# Altium schematic sheet LPC1768.SchDoc: LPC1768
size A4; Organization: UNSW Solar Racing Team; Address3: UNSW; Address4: Sydney NSW 2052; Address2: Electrical Engineering; Address1: Room 342
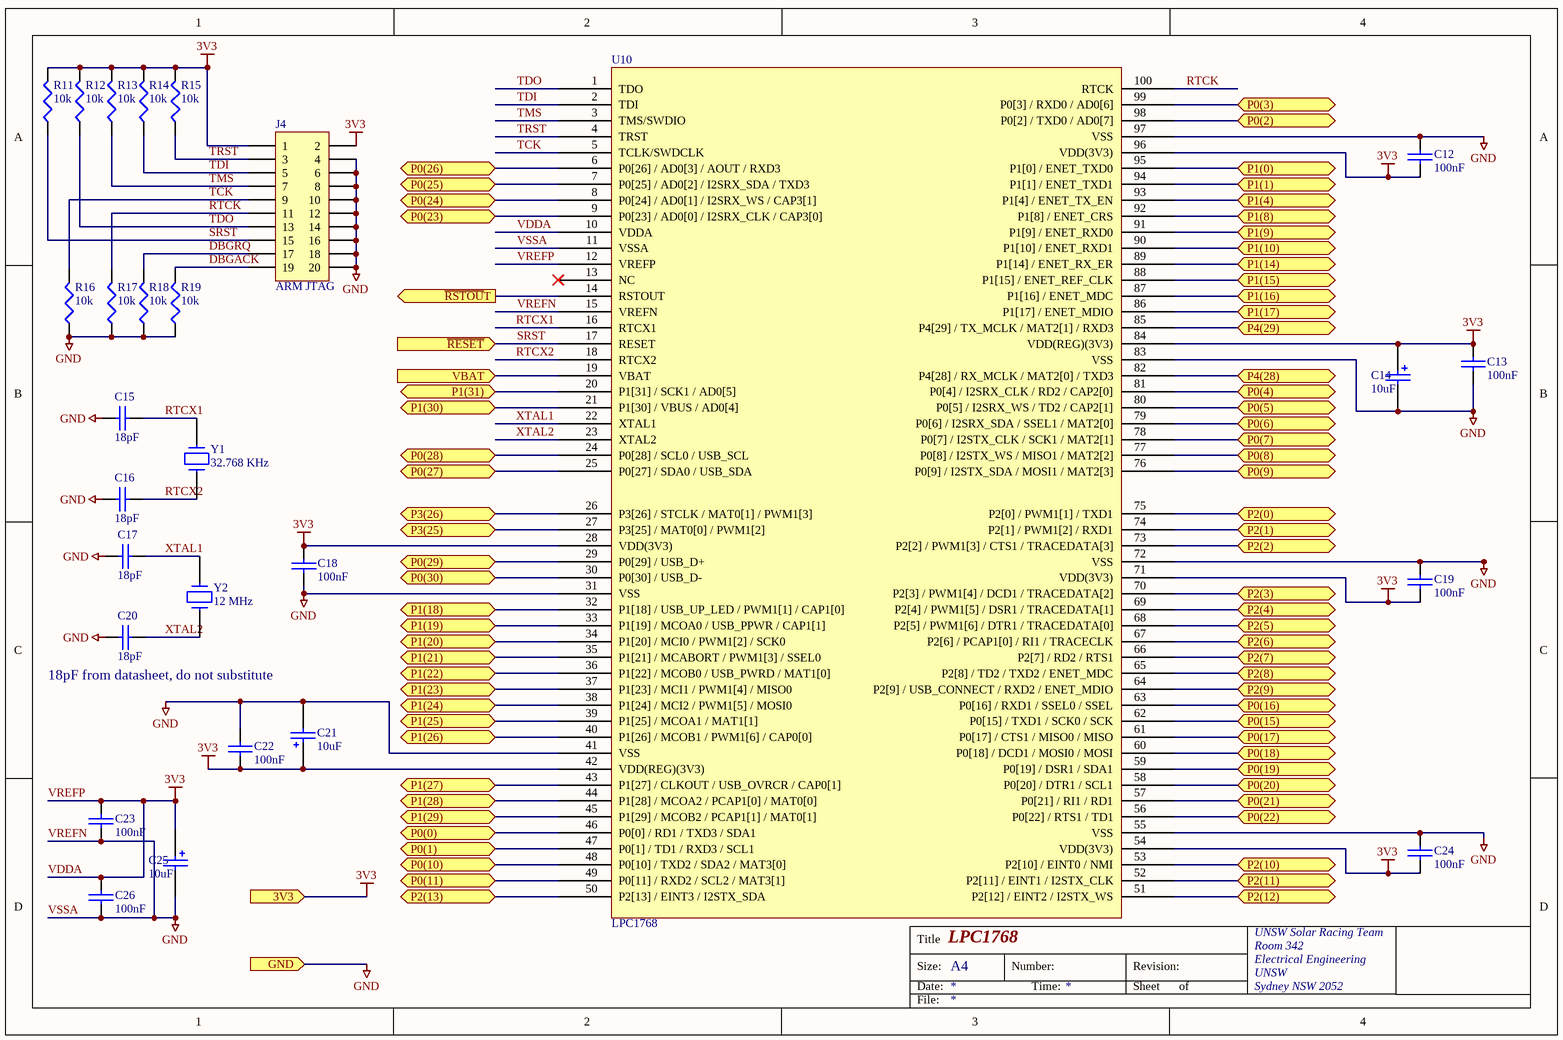
[diagram p0: LPC1768.SchDoc]

## Parts
C12  100nF  [0603]
C13  100nF  [0603]
C14  10uF  [MCCT-CASEA]
C15  18pF  [0603]
C16  18pF  [0603]
C17  18pF  [0603]
C18  100nF  [0603]
C19  100nF  [0603]
C20  18pF  [0603]
C21  10uF  [MCCT-CASEA]
C22  100nF  [0603]
C23  100nF  [0603]
C24  100nF  [0603]
C25  10uF  [MCCT-CASEA]
C26  100nF  [0603]
J4  ARM JTAG  [HDR2X10]
R11  10k  [0603]
R12  10k  [0603]
R13  10k  [0603]
R14  10k  [0603]
R15  10k  [0603]
R16  10k  [0603]
R17  10k  [0603]
R18  10k  [0603]
R19  10k  [0603]
U10  LPC1768  [QFP100]
Y1  32.768 KHz  [WATCHA]
Y2  12 MHz  [HC49/4H]

## Ports
3V3, GND, P0(0), P0(1), P0(2), P0(3), P0(4), P0(5), P0(6), P0(7), P0(8), P0(9), P0(10), P0(11), P0(15), P0(16), P0(17), P0(18), P0(19), P0(20), P0(21), P0(22), P0(23), P0(24), P0(25), P0(26), P0(27), P0(28), P0(29), P0(30), P1(0), P1(1), P1(4), P1(8), P1(9), P1(10), P1(14), P1(15), P1(16), P1(17), P1(18), P1(19), P1(20), P1(21), P1(22), P1(23), P1(24), P1(25), P1(26), P1(27), P1(28), P1(29), P1(30), P1(31), P2(0), P2(1), P2(2), P2(3), P2(4), P2(5), P2(6), P2(7), P2(8), P2(9), P2(10), P2(11), P2(12), P2(13), P3(25), P3(26), P4(28), P4(29), VBAT (in), ~{RESET} (in), ~{RSTOU}T (out)

## Nets
VDDA: C12.2 C13.1 C14.1 C18.1 C19.2 C21.1 C22.2 C23.1 C24.2 C25.1 C26.1 J4.1 J4.2 R11.2 R12.2 R13.2 R14.2 R15.2 U10.10(VDDA) U10.12(VREFP) U10.28(VDD(3V3)) U10.42(VDD(REG)(3V3)) U10.54(VDD(3V3)) U10.71(VDD(3V3)) U10.84(VDD(REG)(3V3)) U10.96(VDD(3V3)) ; port 3V3  [also labelled 3V3, VREFP]
VREFN: C12.1 C13.2 C14.2 C15.2 C16.2 C17.2 C18.2 C19.1 C20.2 C21.2 C22.1 C23.2 C24.1 C25.2 C26.2 J4.4 J4.6 J4.8 J4.10 J4.12 J4.14 J4.16 J4.18 J4.20 R16.1 R17.1 R18.1 R19.1 U10.11(VSSA) U10.15(VREFN) U10.31(VSS) U10.41(VSS) U10.55(VSS) U10.72(VSS) U10.83(VSS) U10.97(VSS) ; port GND  [also labelled GND, VSSA]
DBGACK: J4.19 R19.2
DBGRQ: J4.17 R18.2
P0(0): U10.46(P0[0]_/_RD1_/_TXD3_/_SDA1) ; port P0(0)
P0(1): U10.47(P0[1]_/_TD1_/_RXD3_/_SCL1) ; port P0(1)
P0(2): U10.98(P0[2]_/_TXD0_/_AD0[7]) ; port P0(2)
P0(3): U10.99(P0[3]_/_RXD0_/_AD0[6]) ; port P0(3)
P0(4): U10.81(P0[4]_/_I2SRX_CLK_/_RD2_/_CAP2[0]) ; port P0(4)
P0(5): U10.80(P0[5]_/_I2SRX_WS_/_TD2_/_CAP2[1]) ; port P0(5)
P0(6): U10.79(P0[6]_/_I2SRX_SDA_/_SSEL1_/_MAT2[0]) ; port P0(6)
P0(7): U10.78(P0[7]_/_I2STX_CLK_/_SCK1_/_MAT2[1]) ; port P0(7)
P0(8): U10.77(P0[8]_/_I2STX_WS_/_MISO1_/_MAT2[2]) ; port P0(8)
P0(9): U10.76(P0[9]_/_I2STX_SDA_/_MOSI1_/_MAT2[3]) ; port P0(9)
P0(10): U10.48(P0[10]_/_TXD2_/_SDA2_/_MAT3[0]) ; port P0(10)
P0(11): U10.49(P0[11]_/_RXD2_/_SCL2_/_MAT3[1]) ; port P0(11)
P0(15): U10.62(P0[15]_/_TXD1_/_SCK0_/_SCK) ; port P0(15)
P0(16): U10.63(P0[16]_/_RXD1_/_SSEL0_/_SSEL) ; port P0(16)
P0(17): U10.61(P0[17]_/_CTS1_/_MISO0_/_MISO) ; port P0(17)
P0(18): U10.60(P0[18]_/_DCD1_/_MOSI0_/_MOSI) ; port P0(18)
P0(19): U10.59(P0[19]_/_DSR1_/_SDA1) ; port P0(19)
P0(20): U10.58(P0[20]_/_DTR1_/_SCL1) ; port P0(20)
P0(21): U10.57(P0[21]_/_RI1_/_RD1) ; port P0(21)
P0(22): U10.56(P0[22]_/_RTS1_/_TD1) ; port P0(22)
P0(23): U10.9(P0[23]_/_AD0[0]_/_I2SRX_CLK_/_CAP3[0]) ; port P0(23)
P0(24): U10.8(P0[24]_/_AD0[1]_/_I2SRX_WS_/_CAP3[1]) ; port P0(24)
P0(25): U10.7(P0[25]_/_AD0[2]_/_I2SRX_SDA_/_TXD3) ; port P0(25)
P0(26): U10.6(P0[26]_/_AD0[3]_/_AOUT_/_RXD3) ; port P0(26)
P0(27): U10.25(P0[27]_/_SDA0_/_USB_SDA) ; port P0(27)
P0(28): U10.24(P0[28]_/_SCL0_/_USB_SCL) ; port P0(28)
P0(29): U10.29(P0[29]_/_USB_D+) ; port P0(29)
P0(30): U10.30(P0[30]_/_USB_D-) ; port P0(30)
P1(0): U10.95(P1[0]_/_ENET_TXD0) ; port P1(0)
P1(1): U10.94(P1[1]_/_ENET_TXD1) ; port P1(1)
P1(4): U10.93(P1[4]_/_ENET_TX_EN) ; port P1(4)
P1(8): U10.92(P1[8]_/_ENET_CRS) ; port P1(8)
P1(9): U10.91(P1[9]_/_ENET_RXD0) ; port P1(9)
P1(10): U10.90(P1[10]_/_ENET_RXD1) ; port P1(10)
P1(14): U10.89(P1[14]_/_ENET_RX_ER) ; port P1(14)
P1(15): U10.88(P1[15]_/_ENET_REF_CLK) ; port P1(15)
P1(16): U10.87(P1[16]_/_ENET_MDC) ; port P1(16)
P1(17): U10.86(P1[17]_/_ENET_MDIO) ; port P1(17)
P1(18): U10.32(P1[18]_/_USB_UP_LED_/_PWM1[1]_/_CAP1[0]) ; port P1(18)
P1(19): U10.33(P1[19]_/_MCOA0_/_USB_PPWR_/_CAP1[1]) ; port P1(19)
P1(20): U10.34(P1[20]_/_MCI0_/_PWM1[2]_/_SCK0) ; port P1(20)
P1(21): U10.35(P1[21]_/_MCABORT_/_PWM1[3]_/_SSEL0) ; port P1(21)
P1(22): U10.36(P1[22]_/_MCOB0_/_USB_PWRD_/_MAT1[0]) ; port P1(22)
P1(23): U10.37(P1[23]_/_MCI1_/_PWM1[4]_/_MISO0) ; port P1(23)
P1(24): U10.38(P1[24]_/_MCI2_/_PWM1[5]_/_MOSI0) ; port P1(24)
P1(25): U10.39(P1[25]_/_MCOA1_/_MAT1[1]) ; port P1(25)
P1(26): U10.40(P1[26]_/_MCOB1_/_PWM1[6]_/_CAP0[0]) ; port P1(26)
P1(27): U10.43(P1[27]_/_CLKOUT_/_USB_OVRCR_/_CAP0[1]) ; port P1(27)
P1(28): U10.44(P1[28]_/_MCOA2_/_PCAP1[0]_/_MAT0[0]) ; port P1(28)
P1(29): U10.45(P1[29]_/_MCOB2_/_PCAP1[1]_/_MAT0[1]) ; port P1(29)
P1(30): U10.21(P1[30]_/_VBUS_/_AD0[4]) ; port P1(30)
P1(31): U10.20(P1[31]_/_SCK1_/_AD0[5]) ; port P1(31)
P2(0): U10.75(P2[0]_/_PWM1[1]_/_TXD1) ; port P2(0)
P2(1): U10.74(P2[1]_/_PWM1[2]_/_RXD1) ; port P2(1)
P2(2): U10.73(P2[2]_/_PWM1[3]_/_CTS1_/_TRACEDATA[3]) ; port P2(2)
P2(3): U10.70(P2[3]_/_PWM1[4]_/_DCD1_/_TRACEDATA[2]) ; port P2(3)
P2(4): U10.69(P2[4]_/_PWM1[5]_/_DSR1_/_TRACEDATA[1]) ; port P2(4)
P2(5): U10.68(P2[5]_/_PWM1[6]_/_DTR1_/_TRACEDATA[0]) ; port P2(5)
P2(6): U10.67(P2[6]_/_PCAP1[0]_/_RI1_/_TRACECLK) ; port P2(6)
P2(7): U10.66(P2[7]_/_RD2_/_RTS1) ; port P2(7)
P2(8): U10.65(P2[8]_/_TD2_/_TXD2_/_ENET_MDC) ; port P2(8)
P2(9): U10.64(P2[9]_/_USB_CONNECT_/_RXD2_/_ENET_MDIO) ; port P2(9)
P2(10): U10.53(P2[10]_/_EINT0_/_NMI) ; port P2(10)
P2(11): U10.52(P2[11]_/_EINT1_/_I2STX_CLK) ; port P2(11)
P2(12): U10.51(P2[12]_/_EINT2_/_I2STX_WS) ; port P2(12)
P2(13): U10.50(P2[13]_/_EINT3_/_I2STX_SDA) ; port P2(13)
P3(25): U10.27(P3[25]_/_MAT0[0]_/_PWM1[2]) ; port P3(25)
P3(26): U10.26(P3[26]_/_STCLK_/_MAT0[1]_/_PWM1[3]) ; port P3(26)
P4(28): U10.82(P4[28]_/_RX_MCLK_/_MAT2[0]_/_TXD3) ; port P4(28)
P4(29): U10.85(P4[29]_/_TX_MCLK_/_MAT2[1]_/_RXD3) ; port P4(29)
~{RSTOU}T: U10.14(RSTOUT) ; port ~{RSTOU}T
RTCK: J4.11 R17.2 U10.100(RTCK)
RTCX1: C15.1 U10.16(RTCX1) Y1.2
RTCX2: C16.1 U10.18(RTCX2) Y1.1
SRST: J4.15 R11.1 U10.17(RESET) ; port ~{RESET}
TCK: J4.9 R16.2 U10.5(TCLK/SWDCLK)
TDI: J4.5 R14.1 U10.2(TDI)
TDO: J4.13 R12.1 U10.1(TDO)
TMS: J4.7 R13.1 U10.3(TMS/SWDIO)
TRST: J4.3 R15.1 U10.4(TRST)
VBAT: U10.19(VBAT) ; port VBAT
XTAL1: C17.1 U10.22(XTAL1) Y2.1
XTAL2: C20.1 U10.23(XTAL2) Y2.2

Not connected (* = marked no-connect by the designer): U10 13(NC)*

## Notes on the sheet
- 18pF from datasheet, do not substitute
- Title
- Size:
- Date:
- A4
- Number:
- Time:
- Revision:
- Sheet
- of
- File:

## Library data of the parts
C12 C13 C18 C19 C22-C24 C26 = CAP: Capacitor; Farnell: 753-567; Price: 0.30
C14 C21 C25 = CAP POL3: Polarized Capacitor (Surface Mount); Revision: July-2002: Re-released for DXP Platform.; Digikey: 399-3687-1-ND; DigikeyPrice: 0.54; Farnell: 1650980; FarnellPrice: 0.786
C15-C17 C20 = CAP: Capacitor; Order#: 721-992; Price: 0.11; Supplier: Farnell
J4 = Header 10X2: Header, 10-Pin, Dual row; Farnell: 9733647; FarnellPrice: 3.38; Digikey: WM8146-ND; DigikeyPrice: 3.39
R11-R19 = RES1: Resistor
U10 = LPC1768: NXP Cortex-M3 Microcontroller, 100pin 100MHz; Farnell: 1718549; FarnellPrice: 18.94; Digikey: 568-4796-ND; DigikeyPrice: 11.44
Y1 Y2 = CRYSTAL
  Y1: Farnell: 1611828; FarnellPrice: 0.401; Digikey: 535-9032-ND; DigikeyPrice: 0.25
  Y2: Farnell: 7940142; FarnellPrice: 0.854; DigikeyPrice: 0.46; Digikey: 887-1013-ND